# Altium schematic sheet Peripherals.SchDoc
size A; SheetNumber: 4; SheetTotal: 6
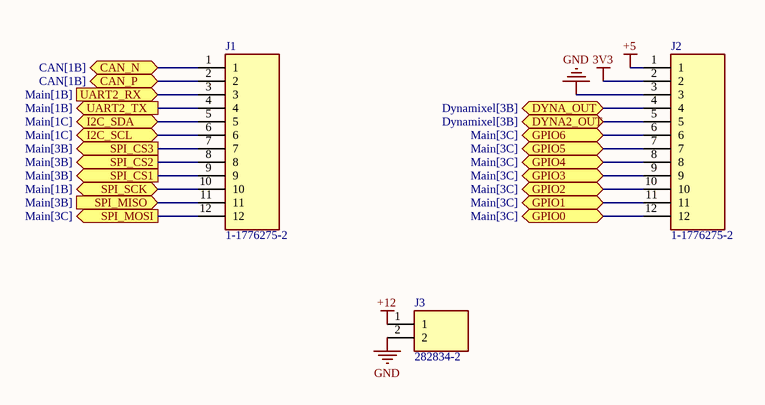
[diagram p0: Peripherals.SchDoc]

## Parts
J1  1-1776275-2  [117762752]
J2  1-1776275-2  [117762752]
J3  282834-2  [282834-2_1]

## Ports
CAN_N (bidir, see CAN[1B]), CAN_P (bidir, see CAN[1B]), DYNA2_OUT (bidir, see Dynamixel[3B]), DYNA_OUT (bidir, see Dynamixel[3B]), GPIO0 (bidir, see Main[3C]), GPIO1 (bidir, see Main[3C]), GPIO2 (bidir, see Main[3C]), GPIO3 (bidir, see Main[3C]), GPIO4 (bidir, see Main[3C]), GPIO5 (bidir, see Main[3C]), GPIO6 (bidir, see Main[3C]), I2C_SCL (bidir, see Main[1C]), I2C_SDA (bidir, see Main[1C]), SPI_CS1 (out, see Main[3B]), SPI_CS2 (out, see Main[3B]), SPI_CS3 (out, see Main[3B]), SPI_MISO (in, see Main[3B]), SPI_MOSI (out, see Main[3C]), SPI_SCK (bidir, see Main[1B]), UART2_RX (in, see Main[1B]), UART2_TX (out, see Main[1B])

## Nets
3V3: J2.2
+5: J2.1
+12: J3.1
GND: J2.3 J3.2
CAN_N: J1.1 ; port CAN_N
CAN_P: J1.2 ; port CAN_P
DYNA2_OUT: J2.5 ; port DYNA2_OUT
DYNA_OUT: J2.4 ; port DYNA_OUT
GPIO0: J2.12 ; port GPIO0
GPIO1: J2.11 ; port GPIO1
GPIO2: J2.10 ; port GPIO2
GPIO3: J2.9 ; port GPIO3
GPIO4: J2.8 ; port GPIO4
GPIO5: J2.7 ; port GPIO5
GPIO6: J2.6 ; port GPIO6
I2C_SCL: J1.6 ; port I2C_SCL
I2C_SDA: J1.5 ; port I2C_SDA
SPI_CS1: J1.9 ; port SPI_CS1
SPI_CS2: J1.8 ; port SPI_CS2
SPI_CS3: J1.7 ; port SPI_CS3
SPI_MISO: J1.11 ; port SPI_MISO
SPI_MOSI: J1.12 ; port SPI_MOSI
SPI_SCK: J1.10 ; port SPI_SCK
UART2_RX: J1.3 ; port UART2_RX
UART2_TX: J1.4 ; port UART2_TX

## Library data of the parts
J1 J2 = 1-1776275-2: Connector; Manufacturer_Name: TE Connectivity; Datasheet Link: https://www.mouser.com/datasheet/2/418/NG_CD_1776275_R1-659562.pdf; Height: 8.6mm; Manufacturer_Part_Number: 1-1776275-2; Mouser Part Number: 571-1-1776275-2; Mouser Price/Stock: https://www.mouser.co.uk/ProductDetail/TE-Connectivity/1-1776275-2?qs=GQ3BsEl46pl%2F8gdkKRu%2FaA%3D%3D
J3 = 282834-2: Connector; Manufacturer_Name: TE Connectivity; Datasheet Link: https://www.te.com/commerce/DocumentDelivery/DDEController?Action=srchrtrv&DocNm=1-1773458-1_EURO_STYLE_QRG&DocType=Data+Sheet&DocLang=English&PartCntxt=282834-2&DocFormat=pdf; Manufacturer_Part_Number: 282834-2; Mouser Part Number: 571-282834-2; Mouser Price/Stock: https://www.mouser.co.uk/ProductDetail/TE-Connectivity/282834-2?qs=A%252Bip%252BNCYi6N8cVKuk8xDog%3D%3D; Arrow Part Number: 282834-2; Arrow Price/Stock: https://www.arrow.com/en/products/282834-2/te-connectivity?region=europe